# EAGLE schematic carcomputer_bottom2 (EAGLE 9.3.2)
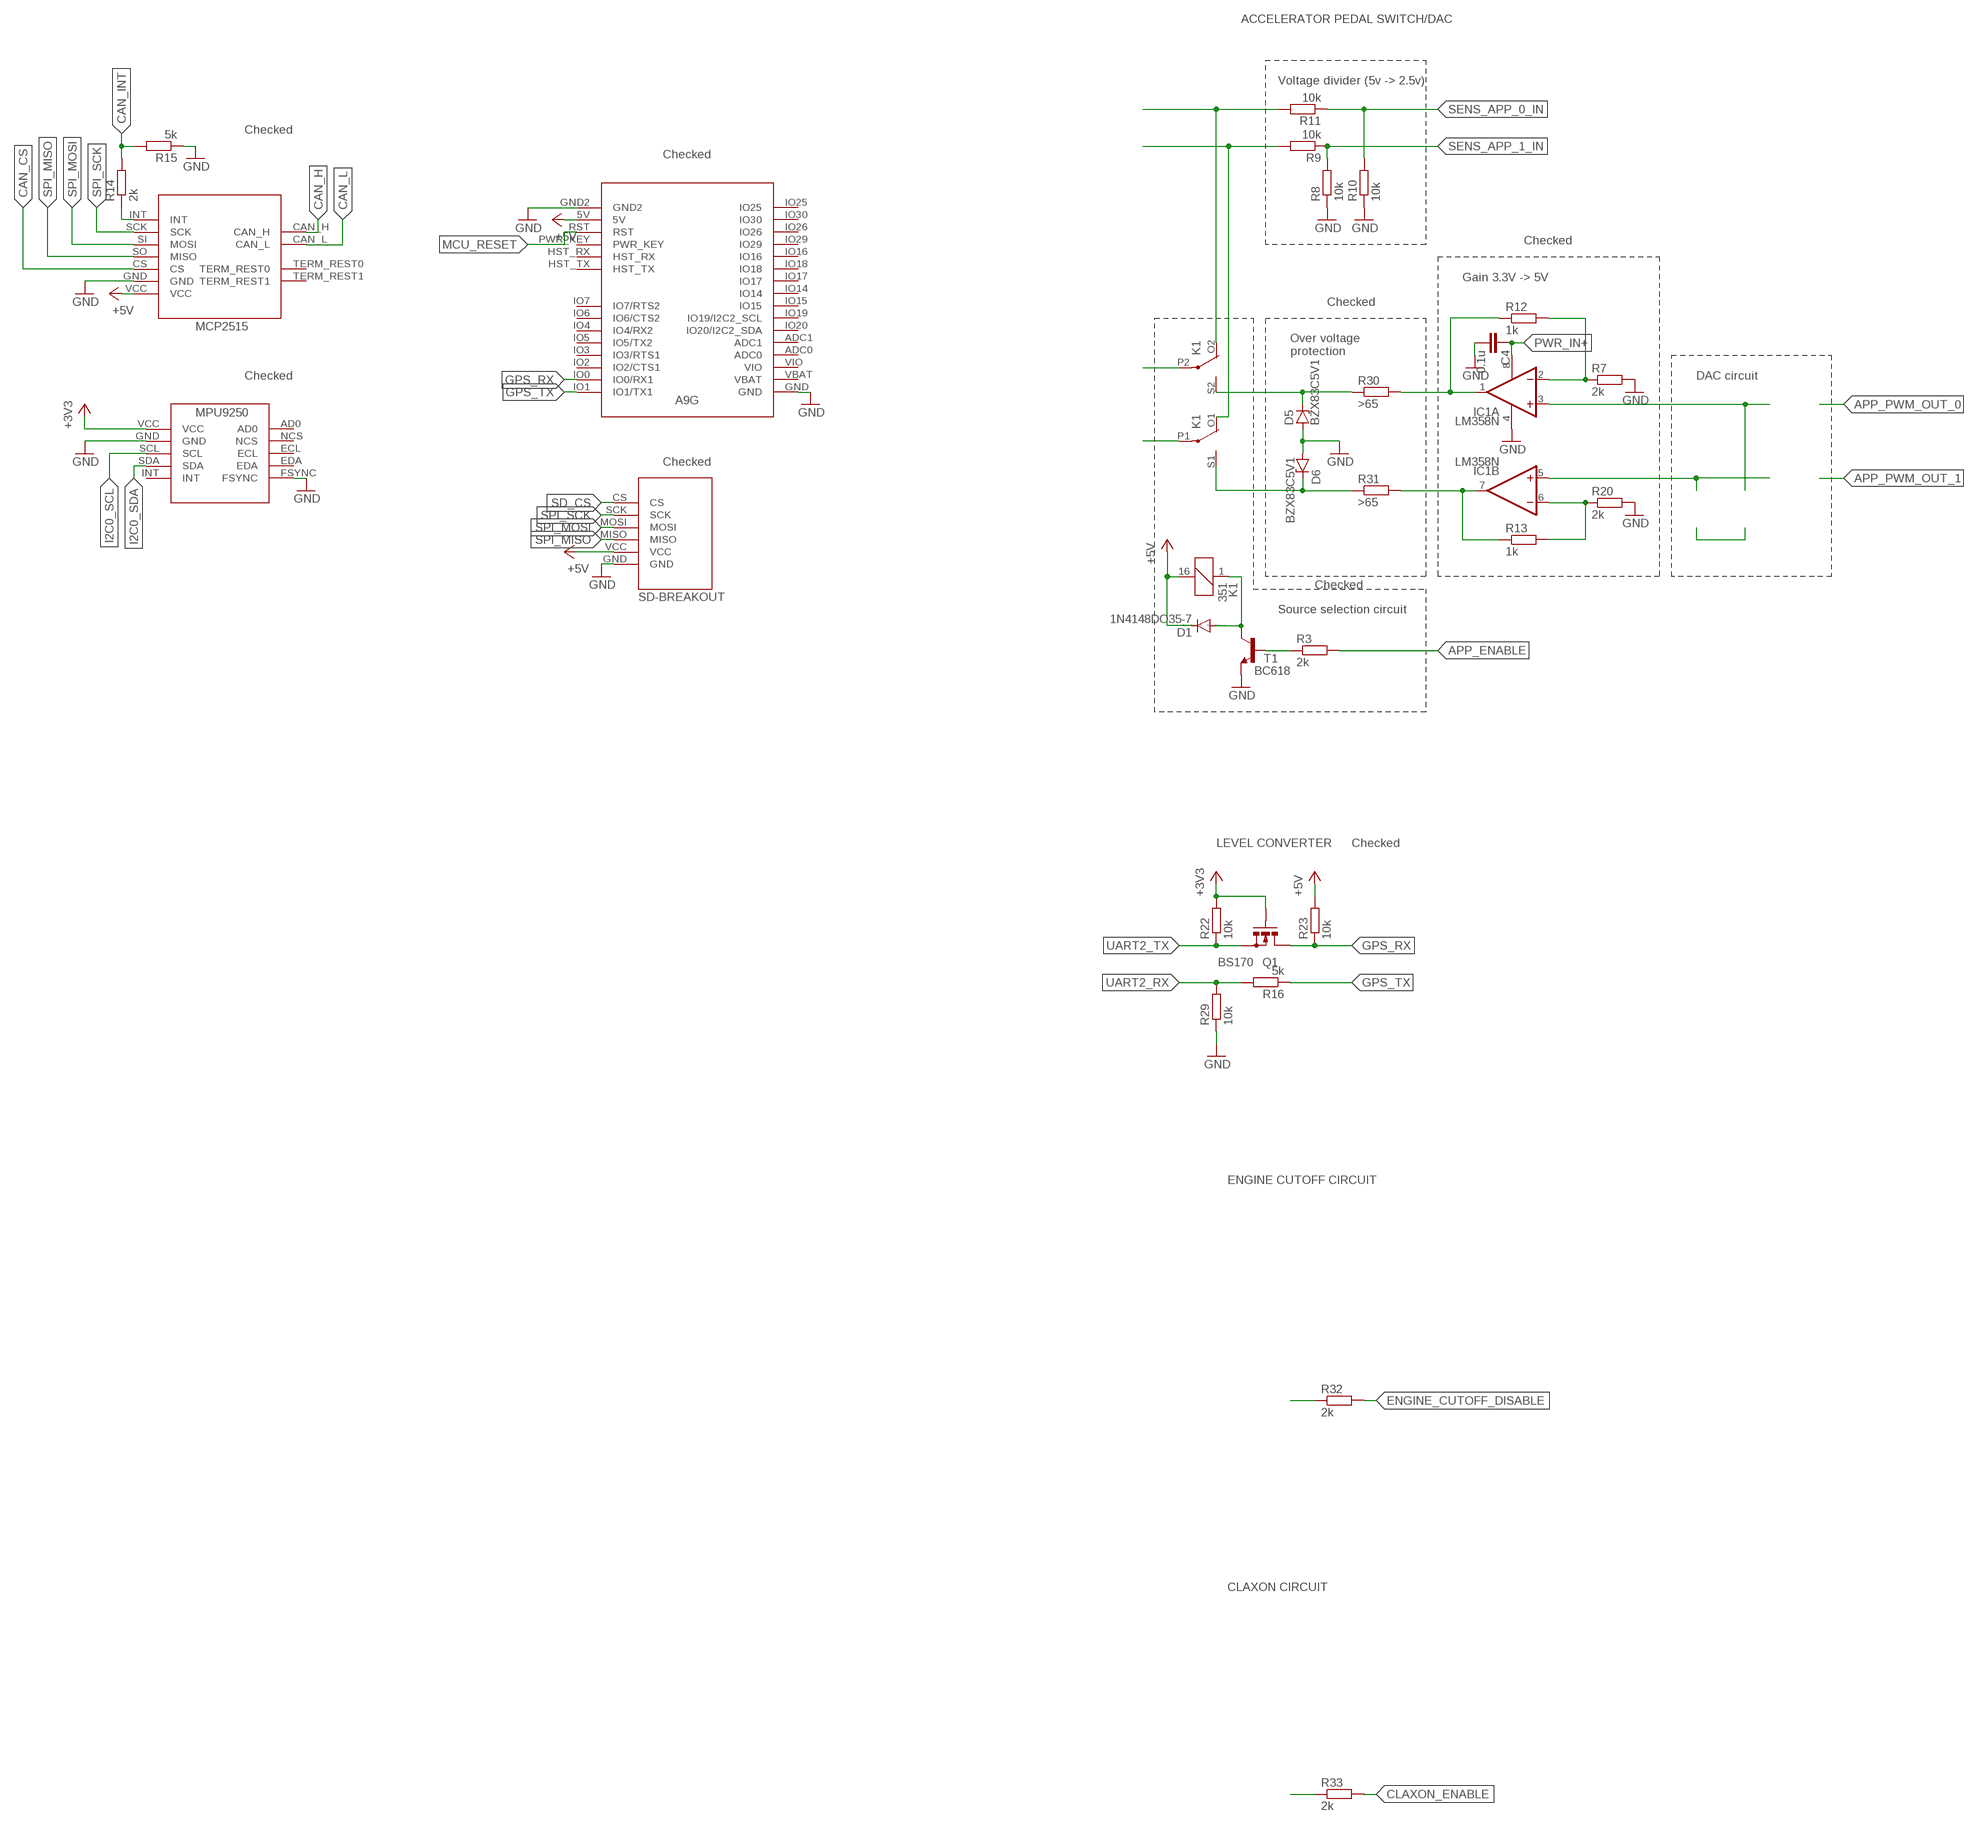
[diagram p0: schematic, sheet 1]

## Parts
C4  0.1u  C-EU025-050X050  [C025-050X050]
D1  1N4148DO35-7  [DO35-7]
D5  BZX83C5V1  BZX85  [DO41Z10]
D6  BZX83C5V1  BZX85  [DO41Z10]
IC1  LM358N  [DIL08]
K1  351  [351]
Q1  BS170  [SOT54E]
R3  2k  R-EU_0207/7  [0207/7]
R7  2k  R-EU_0207/7  [0207/7]
R8  10k  R-EU_0207/7  [0207/7]
R9  10k  R-EU_0207/7  [0207/7]
R10  10k  R-EU_0207/7  [0207/7]
R11  10k  R-EU_0207/7  [0207/7]
R12  1k  R-EU_0207/7  [0207/7]
R13  1k  R-EU_0207/7  [0207/7]
R14  2k  R-EU_0207/7  [0207/7]
R15  5k  R-EU_0207/7  [0207/7]
R16  5k  R-EU_0207/7  [0207/7]
R20  2k  R-EU_0207/7  [0207/7]
R22  10k  R-EU_0207/7  [0207/7]
R23  10k  R-EU_0207/7  [0207/7]
R29  10k  R-EU_0207/7  [0207/7]
R30  >65  R-EU_0207/7  [0207/7]
R31  >65  R-EU_0207/7  [0207/7]
R32  2k  R-EU_0207/7  [0207/7]
R33  2k  R-EU_0207/7  [0207/7]
T1  BC618  [TO92-EBC]
U$2  MCP2515_DEVBOARDINVERTED  [MCP2515_DEVBOARD_INVERTED]
U$3  MPU9250_BREAKOUT  [MPU9250_BREAKOUT]
U$5  HKD-MICRO-SD-BREAKOUT  [HKD-MICRO-SD-BREAKOUT]
U$6  A9G  [A9G]

## Nets
+3V3: Q1.G R22.2 U$3.VCC
+5V: D1.C K1.16 R23.2 U$2.VCC U$5.VCC U$6.5V
APP_0_IN: K1.O2(3:O) R11.2
APP_1_IN: K1.O1(2:O) R9.2
APP_ENABLE: R3.2
CAN_CS: U$2.CS
CAN_H: U$2.CAN_H
CAN_INT: R14.2 R15.2
CAN_L: U$2.CAN_L
CLAXON_ENABLE: R33.2
ENGINE_CUTOFF_DISABLE: R32.2
GND: C4.2 D5.A D6.A IC1.4(P:V-) R7.2 R8.1 R10.1 R15.1 R20.2 R29.1 T1.E U$2.GND U$3.FSYNC U$3.GND U$5.GND U$6.GND U$6.GND2
GPS_RX: Q1.D R23.1 U$6.IO0(IO0/RX1)
GPS_TX: R16.1 U$6.IO1(IO1/TX1)
I2C0_SCL: U$3.SCL
I2C0_SDA: U$3.SDA
MCU_RESET: U$6.RST
N$1: D1.A K1.1 T1.C
N$2: R3.1 T1.B
N$3: D6.C K1.S1(2:S) R31.1
N$4: IC1.1(A:OUT) R12.1 R30.2
N$6: K1.P1(2:P)
N$7: K1.P2(3:P)
N$8: IC1.3(A:+IN)
N$9: IC1.5(B:+IN)
N$10: R14.1 U$2.INT
N$13: IC1.2(A:-IN) R7.1 R12.2
N$16: IC1.6(B:-IN) R13.2 R20.1
N$17: D5.C K1.S2(3:S) R30.1
N$18: IC1.7(B:OUT) R13.1 R31.2
N$25: R33.1
N$26: R32.1
PWR_IN+: C4.1 IC1.8(P:V+)
SD_CS: U$5.CS
SENS_APP_0_IN: R10.2 R11.1
SENS_APP_1_IN: R8.2 R9.1
SPI_MISO: U$2.SO(MISO) U$5.MISO
SPI_MOSI: U$2.SI(MOSI) U$5.MOSI
SPI_SCK: U$2.SCK U$5.SCK
UART2_RX: R16.2 R29.2
UART2_TX: Q1.S R22.1
Unconnected: U$2.TERM_REST0 U$2.TERM_REST1 U$3.AD0 U$3.ECL U$3.EDA U$3.INT U$3.NCS U$6.ADC0 U$6.ADC1 U$6.HST_RX U$6.HST_TX U$6.IO2(IO2/CTS1) U$6.IO3(IO3/RTS1) U$6.IO4(IO4/RX2) U$6.IO5(IO5/TX2) U$6.IO6(IO6/CTS2) U$6.IO7(IO7/RTS2) U$6.IO14 U$6.IO15 U$6.IO16 U$6.IO17 U$6.IO18 U$6.IO19(IO19/I2C2_SCL) U$6.IO20(IO20/I2C2_SDA) U$6.IO25 U$6.IO26 U$6.IO29 U$6.IO30 U$6.PWR_KEY U$6.VBAT U$6.VIO

## Notes on the sheet
- ACCELERATOR PEDAL SWITCH/DAC
- Voltage divider (5v -> 2.5v)
- Checked
- Checked
- Checked
- Gain 3.3V -> 5V
- Checked
- Over voltage
  protection
- Checked | DAC circuit
- Checked
- Checked
- Source selection circuit
- LEVEL CONVERTER | Checked
- ENGINE CUTOFF CIRCUIT
- CLAXON CIRCUIT

## Library data of the parts
C4 = rcl:C-EU: CAPACITOR, European symbol; SPICEPREFIX: C
D1 = diode:1N4148: DIODE high speed (Philips)
D5 D6 = diode:BZX85: Z DIODE
IC1 = linear:LM358: OP AMP also LM158; LM258; LM2904 Source: http://cache.national.com/ds/LM/LM158.pdf
K1 = relay:351: RELAY 2 x switch, Omron; OC_FARNELL: unknown; OC_NEWARK: unknown
Q1 = transistor-small-signal:BS170: N-CHANNEL MOS FET
R3 R7-R16 R20 R22 R23 R29-R33 = rcl:R-EU_: RESISTOR, European symbol; SPICEPREFIX: R
T1 = transistor-npn:BC618*: NPN Transistor
U$2 = MCP2515:MCP2515_DEVBOARD
U$3 = MPU9250:MPU9250_BREAKOUT
U$5 = sd-mmc:HKD-MICRO-SD-BREAKOUT
U$6 = A9:A9G